# Altium schematic sheet EMULATOR_INTERFACE.SchDoc: F2837x controlCARD
size 431 x 279 mm; Organization: Texas Instruments; Revision: 1.3
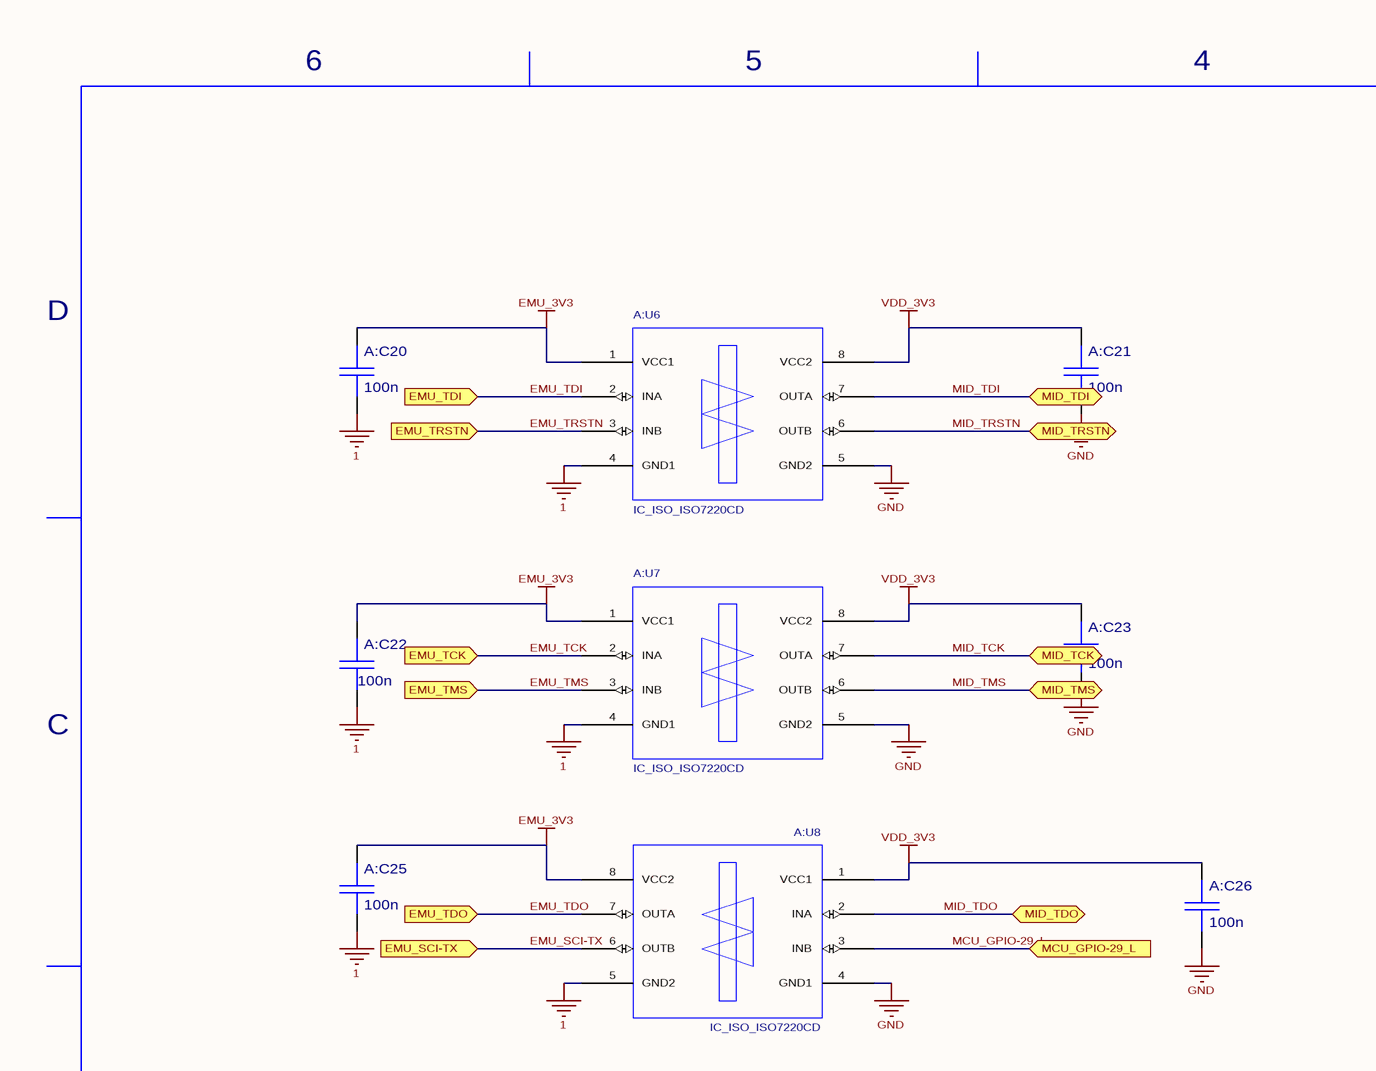
[diagram p0: EMULATOR_INTERFACE.SchDoc, top left]
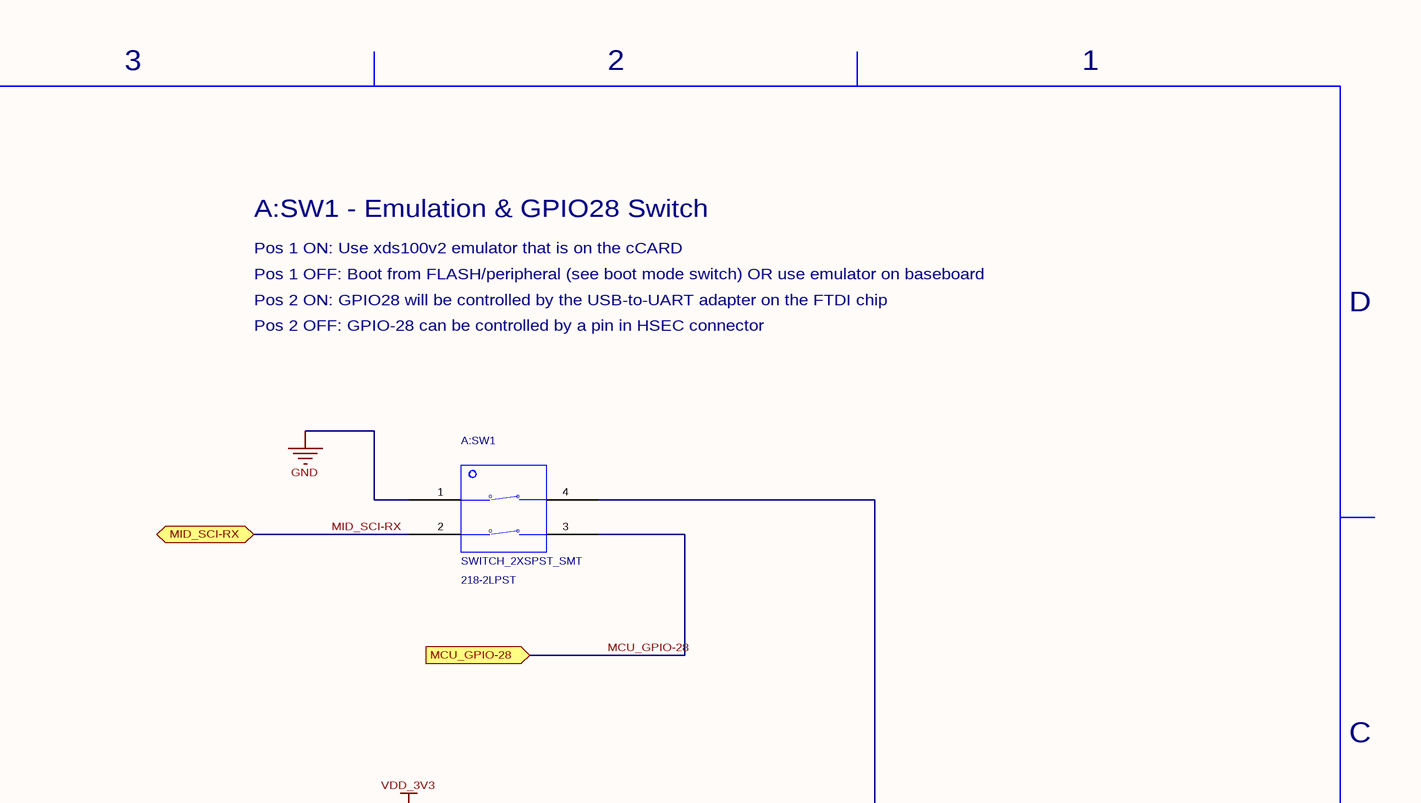
[diagram p1: EMULATOR_INTERFACE.SchDoc, top right]
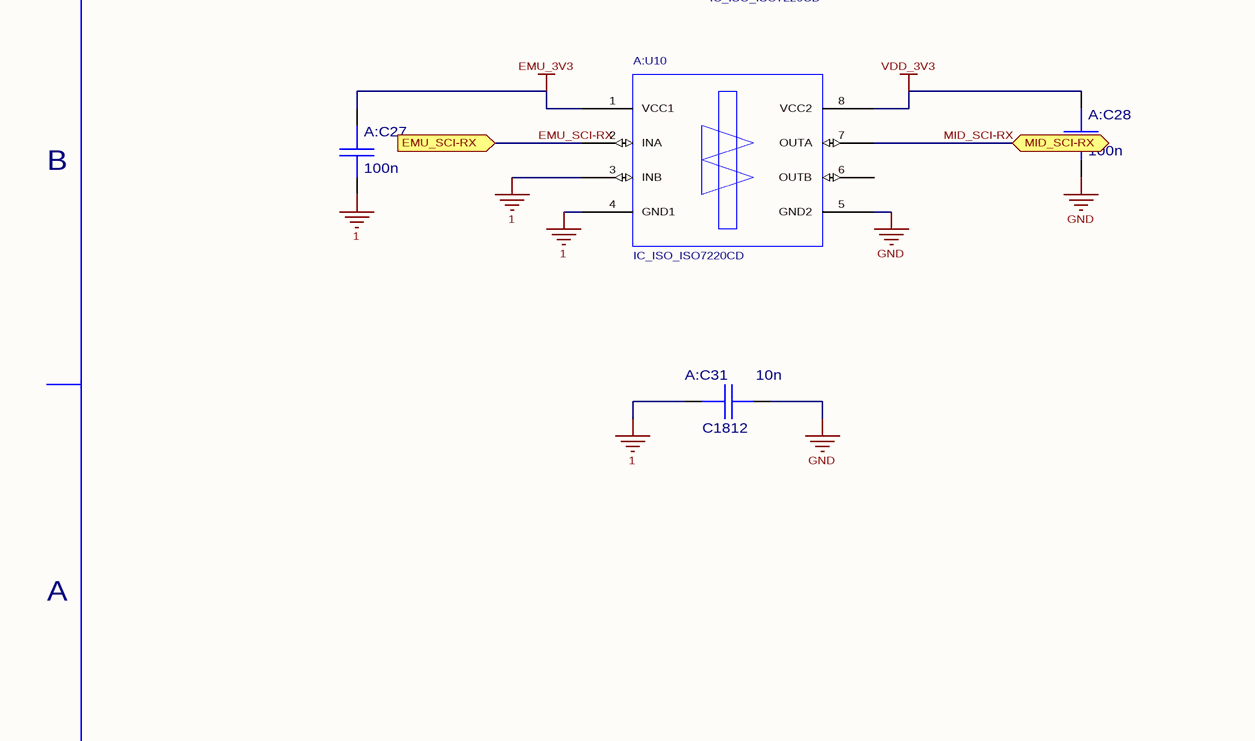
[diagram p2: EMULATOR_INTERFACE.SchDoc, bottom left]
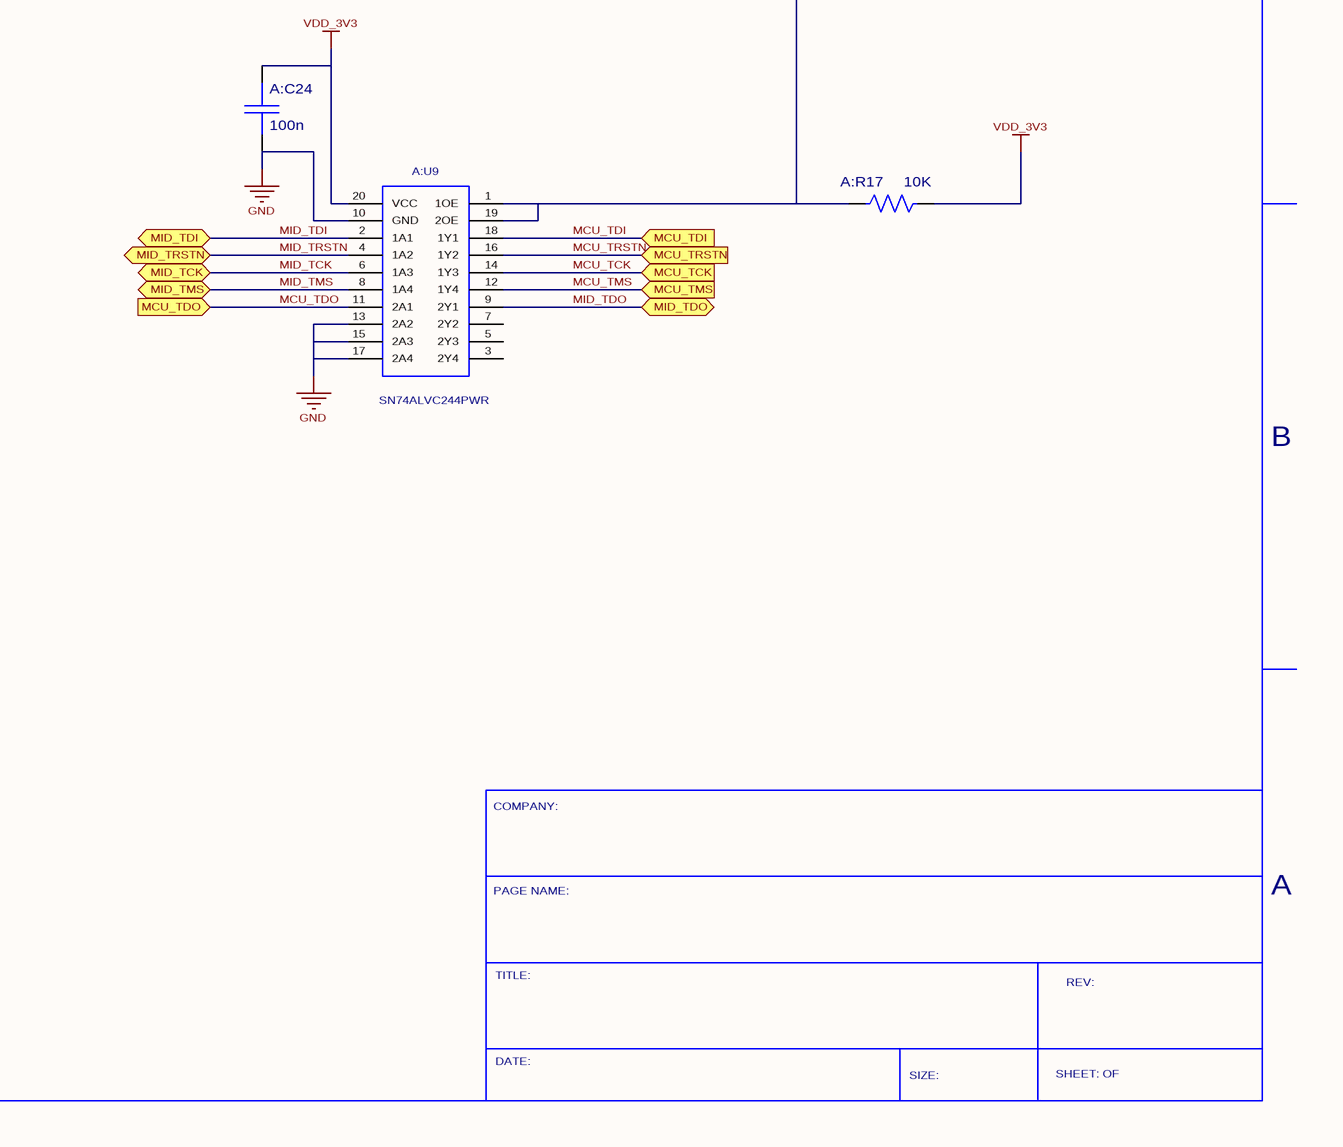
[diagram p3: EMULATOR_INTERFACE.SchDoc, bottom right]

## Parts
A:C20  value 100n  [C0402]  (hidden comment: C0402_16V_X7R)
A:C21  value 100n  [C0402]  (hidden comment: C0402_16V_X7R)
A:C22  value 100n  [C0402]  (hidden comment: C0402_16V_X7R)
A:C23  value 100n  [C0402]  (hidden comment: C0402_16V_X7R)
A:C24  value 100n  [C0402]  (hidden comment: C0402_16V_X7R)
A:C25  value 100n  [C0402]  (hidden comment: C0402_16V_X7R)
A:C26  value 100n  [C0402]  (hidden comment: C0402_16V_X7R)
A:C27  value 100n  [C0402]  (hidden comment: C0402_16V_X7R)
A:C28  value 100n  [C0402]  (hidden comment: C0402_16V_X7R)
A:C31  value 10n  [C1812]  (hidden comment: C1812_1.5KV_X7R)
A:R17  value 10K  [R0402]  (hidden comment: R0402_5%)
A:SW1  SWITCH_2XSPST_SMT  Part Number: 218-2LPST  [SW_2POS_CTS218]
A:U6  IC_ISO_ISO7220CD  [SOIC-8]
A:U7  IC_ISO_ISO7220CD  [SOIC-8]
A:U8  IC_ISO_ISO7220CD  [SOIC-8]
A:U9  Part Number: SN74ALVC244PWR  [TSSOP20_PW]  (hidden comment: IC_LOGIC_SN74ALVC244PW_3S-BUFFER)
A:U10  IC_ISO_ISO7220CD  [SOIC-8]

## Ports
EMU_SCI-RX, EMU_SCI-TX, EMU_TCK, EMU_TDI, EMU_TDO, EMU_TMS, EMU_TRSTN, MCU_GPIO-28, MCU_GPIO-29_L, MCU_TCK, MCU_TDI, MCU_TDO, MCU_TMS, MCU_TRSTN, MID_SCI-RX (bidir), MID_TCK (bidir), MID_TDI (bidir), MID_TDO (bidir), MID_TMS (bidir), MID_TRSTN (bidir)

## Nets
1: A:C20.1 A:C22.1 A:C25.1 A:C27.1 A:C31.2 A:U6.4(GND1) A:U7.4(GND1) A:U8.5(GND2) A:U10.3(INB) A:U10.4(GND1)
EMU_3V3: A:C20.2 A:C22.2 A:C25.2 A:C27.2 A:U6.1(VCC1) A:U7.1(VCC1) A:U8.8(VCC2) A:U10.1(VCC1)
GND: A:C21.1 A:C23.1 A:C24.1 A:C26.1 A:C28.1 A:C31.1 A:SW1.1(A_OUT1) A:U6.5(GND2) A:U7.5(GND2) A:U8.4(GND1) A:U9.10(GND) A:U9.13(2A2) A:U9.15(2A3) A:U9.17(2A4) A:U10.5(GND2)
VDD_3V3: A:C21.2 A:C23.2 A:C24.2 A:C26.2 A:C28.2 A:R17.2 A:U6.8(VCC2) A:U7.8(VCC2) A:U8.1(VCC1) A:U9.20(VCC) A:U10.8(VCC2)
EMU_SCI-RX: A:U10.2(INA) ; port EMU_SCI-RX
EMU_SCI-TX: A:U8.6(OUTB) ; port EMU_SCI-TX
EMU_TCK: A:U7.2(INA) ; port EMU_TCK
EMU_TDI: A:U6.2(INA) ; port EMU_TDI
EMU_TDO: A:U8.7(OUTA) ; port EMU_TDO
EMU_TMS: A:U7.3(INB) ; port EMU_TMS
EMU_TRSTN: A:U6.3(INB) ; port EMU_TRSTN
MCU_GPIO-28: A:SW1.3(B_IN1) ; port MCU_GPIO-28
MCU_GPIO-29_L: A:U8.3(INB) ; port MCU_GPIO-29_L
MCU_TCK: A:U9.14(1Y3) ; port MCU_TCK
MCU_TDI: A:U9.18(1Y1) ; port MCU_TDI
MCU_TDO: A:U9.11(2A1) ; port MCU_TDO
MCU_TMS: A:U9.12(1Y4) ; port MCU_TMS
MCU_TRSTN: A:U9.16(1Y2) ; port MCU_TRSTN
MID_SCI-RX: A:SW1.2(B_OUT2) A:U10.7(OUTA) ; port MID_SCI-RX
MID_TCK: A:U7.7(OUTA) A:U9.6(1A3) ; port MID_TCK
MID_TDI: A:U6.7(OUTA) A:U9.2(1A1) ; port MID_TDI
MID_TDO: A:U8.2(INA) A:U9.9(2Y1) ; port MID_TDO
MID_TMS: A:U7.6(OUTB) A:U9.8(1A4) ; port MID_TMS
MID_TRSTN: A:U6.6(OUTB) A:U9.4(1A2) ; port MID_TRSTN
NetA:R17_1: A:R17.1 A:SW1.4(A_IN1) A:U9.1(1OE) A:U9.19(2OE)

Not connected (* = marked no-connect by the designer): A:U9 3(2Y4) 5(2Y3) 7(2Y2); A:U10 6(OUTB)

## Notes on the sheet
- 6
- 5
- 4
- 3
- 2
- 1
- A:SW1 - Emulation & GPIO28 Switch
- Pos 1 ON: Use xds100v2 emulator that is on the cCARD
- Pos 1 OFF: Boot from FLASH/peripheral (see boot mode switch) OR use emulator on baseboard
- Pos 2 ON: GPIO28 will be controlled by the USB-to-UART adapter on the FTDI chip
- D
- Pos 2 OFF: GPIO-28 can be controlled by a pin in HSEC connector
- C
- B
- COMPANY:
- A
- PAGE NAME:
- TITLE:
- REV:
- DATE:
- SIZE:
- SHEET: OF
- (in symbol SWITCH_2XSPST_SMT) o

## Library data of the parts
A:C20-A:C28 = C0402_16V_X7R: CAP CER 16V 10% X7R 0402; Decal: C0402; PCB DECAL: C0402
A:C31 = C1812_1.5KV_X7R: CAP CER 1.5KV 10% X7R 1812; Part Number: 1812SC103KAT1A; Decal: C1812; Digikey: 478-4735-1-ND; PCB DECAL: C1812
A:R17 = R0402_5%: RES 1/16W 5% 0402 SMD; Decal: R0402; PCB DECAL: R0402
A:SW1 = SWITCH_2XSPST_SMT: 2xSPST DIP switch SMT, half-pitch; Manufacturer: CTS Electrocomponents; Value: 218-2LPST; PCB DECAL: SW_2POS_CTS218; Decal: SW_2POS_CTS218; Digikey: CT2182LPST-ND; Size: 3.71 L x 8.89 W, 1.27 LS (mm); Height: 2.65 (mm)
A:U6-A:U8 A:U10 = IC_ISO_ISO7220CD: IC DGTL ISOLATOR 25MBPS 2CH 8SOIC; Decal: SOIC-8; Digikey: 296-21953-1-ND; Part Number: ISO7220CD; PCB DECAL: SOIC-8
A:U9 = IC_LOGIC_SN74ALVC244PW_3S-BUFFER: 3-State Buffer, 2 elements x 4 bits; Manufacturer: Texas Instruments; Decal: TBD; Digikey: 296-5136-1-ND; Value: 3-State Buffer; PCB DECAL: TSSOP20_PW